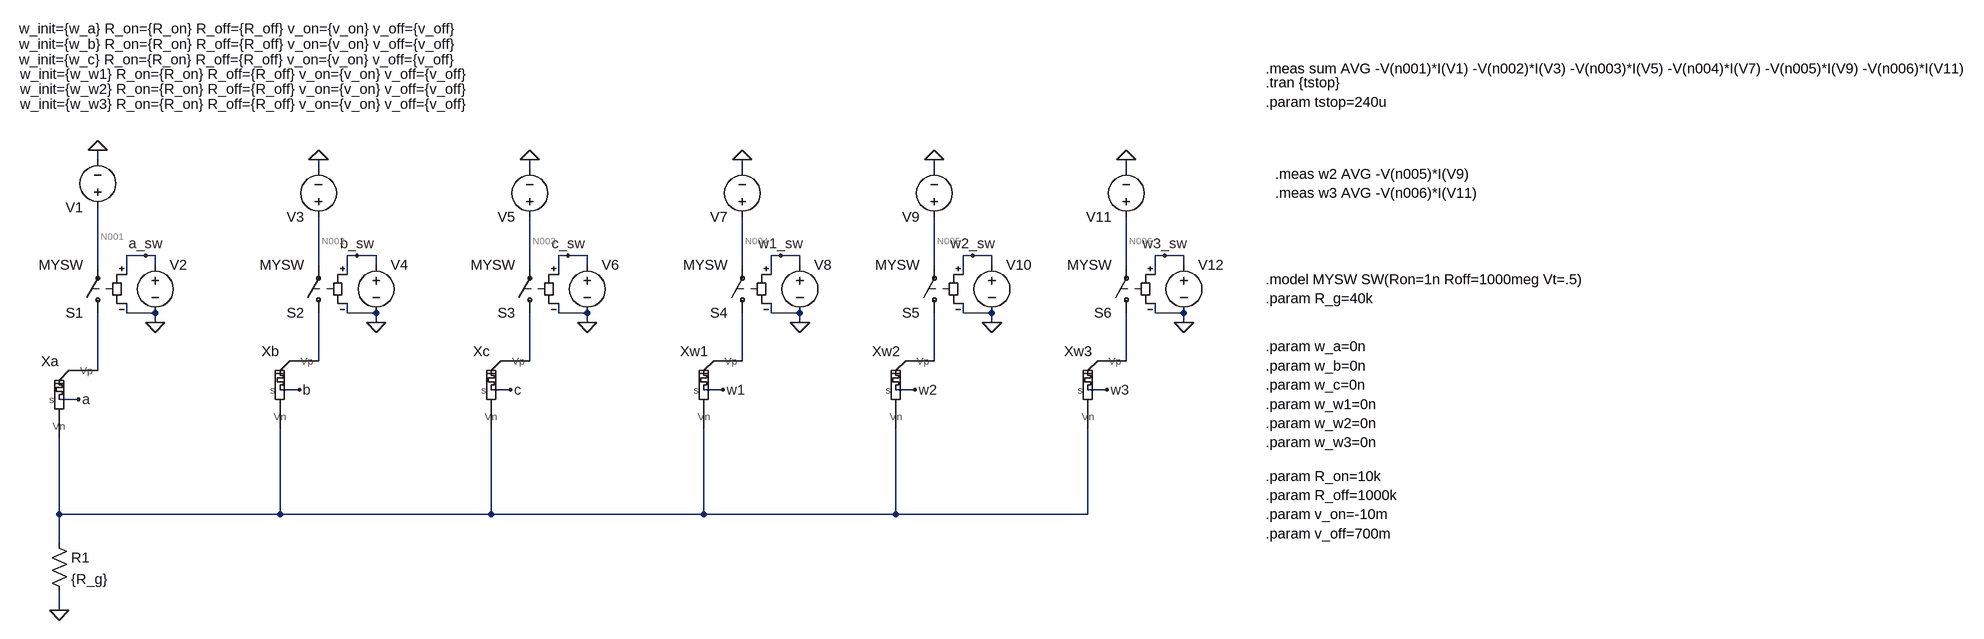
[diagram p0: schematic 1bit_adder_cin.asc]
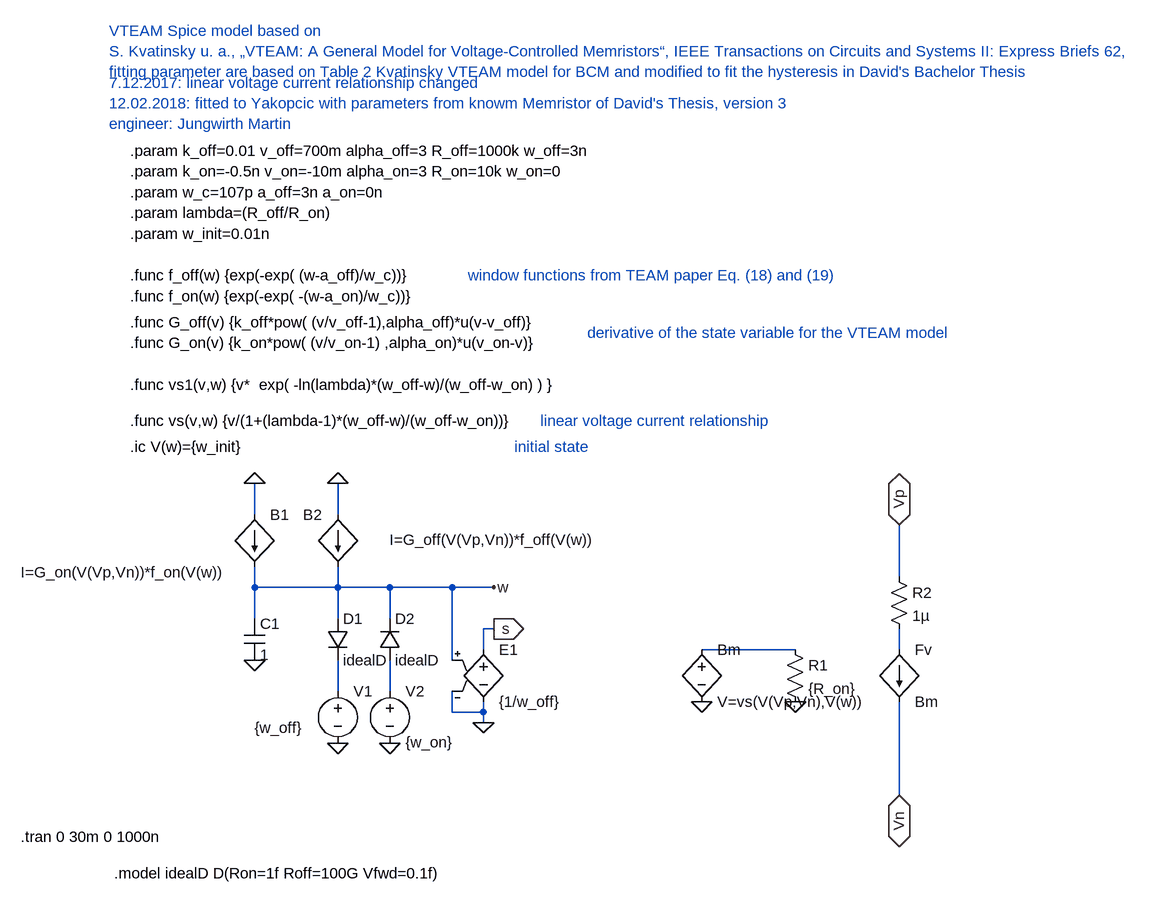
[diagram p1: sub-circuit vteam_knowm.asc]
1bit_adder_cin.asc, the LTspice schematic file:
Version 4
SHEET 1 2472 1840
WIRE -1360 144 -1360 128
WIRE -992 160 -992 144
WIRE -640 160 -640 144
WIRE -224 160 -224 144
WIRE 96 160 96 144
WIRE 416 160 416 144
WIRE -1280 304 -1312 304
WIRE -1264 304 -1280 304
WIRE -928 304 -944 304
WIRE -896 304 -928 304
WIRE -576 304 -592 304
WIRE -544 304 -576 304
WIRE -160 304 -176 304
WIRE -128 304 -160 304
WIRE 160 304 144 304
WIRE 192 304 160 304
WIRE 480 304 464 304
WIRE 512 304 480 304
WIRE -1360 320 -1360 224
WIRE -1264 320 -1264 304
WIRE -992 320 -992 240
WIRE -896 320 -896 304
WIRE -640 320 -640 240
WIRE -544 320 -544 304
WIRE -224 320 -224 240
WIRE -128 320 -128 304
WIRE 96 320 96 240
WIRE 192 320 192 304
WIRE 416 320 416 240
WIRE 512 320 512 304
WIRE -1312 336 -1312 304
WIRE -944 336 -944 304
WIRE -592 336 -592 304
WIRE -176 336 -176 304
WIRE 144 336 144 304
WIRE 464 336 464 304
WIRE -1312 400 -1312 384
WIRE -1264 400 -1312 400
WIRE -944 400 -944 384
WIRE -896 400 -944 400
WIRE -592 400 -592 384
WIRE -544 400 -592 400
WIRE -176 400 -176 384
WIRE -128 400 -176 400
WIRE 144 400 144 384
WIRE 192 400 144 400
WIRE 464 400 464 384
WIRE 512 400 464 400
WIRE -1264 416 -1264 400
WIRE -896 416 -896 400
WIRE -544 416 -544 400
WIRE -128 416 -128 400
WIRE 192 416 192 400
WIRE 512 416 512 400
WIRE -992 480 -992 400
WIRE -640 480 -640 400
WIRE -224 480 -224 400
WIRE 96 480 96 400
WIRE 416 480 416 400
WIRE -1360 496 -1360 400
WIRE -1024 528 -1056 528
WIRE -672 528 -704 528
WIRE -256 528 -288 528
WIRE 64 528 32 528
WIRE 384 528 352 528
WIRE -1392 544 -1424 544
WIRE -1424 736 -1424 608
WIRE -1056 736 -1056 592
WIRE -1056 736 -1424 736
WIRE -704 736 -704 592
WIRE -704 736 -1056 736
WIRE -288 736 -288 592
WIRE -288 736 -704 736
WIRE 32 736 32 592
WIRE 32 736 -288 736
WIRE 352 736 352 592
WIRE 352 736 32 736
WIRE -1424 784 -1424 736
WIRE -1424 896 -1424 864
FLAG -1424 896 0
FLAG -1360 128 0
FLAG -992 144 0
FLAG -1264 416 0
FLAG -896 416 0
FLAG -1024 528 b
FLAG -1280 304 a_sw
FLAG -928 304 b_sw
FLAG -224 144 0
FLAG -128 416 0
FLAG -256 528 w1
FLAG -160 304 w1_sw
FLAG -1392 544 a
FLAG 96 144 0
FLAG 192 416 0
FLAG 64 528 w2
FLAG 160 304 w2_sw
FLAG -640 144 0
FLAG -544 416 0
FLAG -672 528 c
FLAG -576 304 c_sw
FLAG 416 144 0
FLAG 512 416 0
FLAG 384 528 w3
FLAG 480 304 w3_sw
SYMBOL res -1440 768 R0
SYMATTR InstName R1
SYMATTR Value {R_g}
SYMBOL voltage -1360 240 R180
WINDOW 3 24 96 Invisible 2
WINDOW 123 0 0 Left 2
WINDOW 39 0 0 Left 2
SYMATTR Value PWL file=a.csv
SYMATTR InstName V1
SYMBOL voltage -992 256 R180
WINDOW 3 24 96 Invisible 2
WINDOW 123 0 0 Left 2
WINDOW 39 0 0 Left 2
SYMATTR Value PWL file=b.csv
SYMATTR InstName V3
SYMBOL sw -1360 416 R180
SYMATTR InstName S1
SYMATTR Value MYSW
SYMBOL voltage -1264 304 R0
WINDOW 3 24 96 Invisible 2
WINDOW 123 0 0 Left 2
WINDOW 39 0 0 Left 2
SYMATTR Value PWL file=a_sw.csv
SYMATTR InstName V2
SYMBOL sw -992 416 R180
SYMATTR InstName S2
SYMATTR Value MYSW
SYMBOL voltage -896 304 R0
WINDOW 3 24 96 Invisible 2
WINDOW 123 0 0 Left 2
WINDOW 39 0 0 Left 2
SYMATTR Value PWL file=b_sw.csv
SYMATTR InstName V4
SYMBOL VTEAM_knowm -1104 480 R0
WINDOW 39 -23 -513 Bottom 2
SYMATTR SpiceLine w_init={w_b} R_on={R_on} R_off={R_off} v_on={v_on} v_off={v_off}
SYMATTR InstName Xb
SYMBOL voltage -224 256 R180
WINDOW 3 24 96 Invisible 2
WINDOW 123 0 0 Left 2
WINDOW 39 0 0 Left 2
SYMATTR Value PWL file=w1.csv
SYMATTR InstName V7
SYMBOL sw -224 416 R180
SYMATTR InstName S4
SYMATTR Value MYSW
SYMBOL voltage -128 304 R0
WINDOW 3 24 96 Invisible 2
WINDOW 123 0 0 Left 2
WINDOW 39 0 0 Left 2
SYMATTR Value PWL file=w1_sw.csv
SYMATTR InstName V8
SYMBOL VTEAM_knowm -336 480 R0
WINDOW 39 -781 -463 Bottom 2
SYMATTR SpiceLine w_init={w_w1} R_on={R_on} R_off={R_off} v_on={v_on} v_off={v_off}
SYMATTR InstName Xw1
SYMBOL VTEAM_knowm -1472 496 R0
WINDOW 39 345 -555 Bottom 2
SYMATTR SpiceLine w_init={w_a} R_on={R_on} R_off={R_off} v_on={v_on} v_off={v_off}
SYMATTR InstName Xa
SYMBOL voltage 96 256 R180
WINDOW 3 24 96 Invisible 2
WINDOW 123 0 0 Left 2
WINDOW 39 0 0 Left 2
SYMATTR Value PWL file=w2.csv
SYMATTR InstName V9
SYMBOL sw 96 416 R180
SYMATTR InstName S5
SYMATTR Value MYSW
SYMBOL voltage 192 304 R0
WINDOW 3 24 96 Invisible 2
WINDOW 123 0 0 Left 2
WINDOW 39 0 0 Left 2
SYMATTR Value PWL file=w2_sw.csv
SYMATTR InstName V10
SYMBOL VTEAM_knowm -16 480 R0
WINDOW 39 -1101 -438 Bottom 2
SYMATTR SpiceLine w_init={w_w2} R_on={R_on} R_off={R_off} v_on={v_on} v_off={v_off}
SYMATTR InstName Xw2
SYMBOL voltage -640 256 R180
WINDOW 3 24 96 Invisible 2
WINDOW 123 0 0 Left 2
WINDOW 39 0 0 Left 2
SYMATTR Value PWL file=c.csv
SYMATTR InstName V5
SYMBOL sw -640 416 R180
SYMATTR InstName S3
SYMATTR Value MYSW
SYMBOL voltage -544 304 R0
WINDOW 3 24 96 Invisible 2
WINDOW 123 0 0 Left 2
WINDOW 39 0 0 Left 2
SYMATTR Value PWL file=c_sw.csv
SYMATTR InstName V6
SYMBOL VTEAM_knowm -752 480 R0
WINDOW 39 -376 -487 Bottom 2
SYMATTR SpiceLine w_init={w_c} R_on={R_on} R_off={R_off} v_on={v_on} v_off={v_off}
SYMATTR InstName Xc
SYMBOL voltage 416 256 R180
WINDOW 3 24 96 Invisible 2
WINDOW 123 0 0 Left 2
WINDOW 39 0 0 Left 2
SYMATTR Value PWL file=w3.csv
SYMATTR InstName V11
SYMBOL sw 416 416 R180
SYMATTR InstName S6
SYMATTR Value MYSW
SYMBOL voltage 512 304 R0
WINDOW 3 24 96 Invisible 2
WINDOW 123 0 0 Left 2
WINDOW 39 0 0 Left 2
SYMATTR Value PWL file=w3_sw.csv
SYMATTR InstName V12
SYMBOL VTEAM_knowm 304 480 R0
WINDOW 39 -1421 -413 Bottom 2
SYMATTR SpiceLine w_init={w_w3} R_on={R_on} R_off={R_off} v_on={v_on} v_off={v_off}
SYMATTR InstName Xw3
TEXT 648 344 Left 2 !.model MYSW SW(Ron=1n Roff=1000meg Vt=.5)
TEXT 648 376 Left 2 !.param R_g=40k
TEXT 648 16 Left 2 !.tran {tstop}
TEXT 648 456 Left 2 !.param w_a=0n
TEXT 648 488 Left 2 !.param w_b=0n
TEXT 648 520 Left 2 !.param w_c=0n
TEXT 648 552 Left 2 !.param w_w1=0n
TEXT 648 584 Left 2 !.param w_w2=0n
TEXT 648 616 Left 2 !.param w_w3=0n
TEXT 648 672 Left 2 !.param R_on=10k
TEXT 648 704 Left 2 !.param R_off=1000k
TEXT 648 -8 Left 2 !.meas sum AVG -V(n001)*I(V1) -V(n002)*I(V3) -V(n003)*I(V5) -V(n004)*I(V7) -V(n005)*I(V9) -V(n006)*I(V11)
TEXT 648 48 Left 2 !.param tstop=240u
TEXT 664 168 Left 2 !.meas w2 AVG -V(n005)*I(V9)
TEXT 664 200 Left 2 !.meas w3 AVG -V(n006)*I(V11)
TEXT 648 736 Left 2 !.param v_on=-10m
TEXT 648 768 Left 2 !.param v_off=700m

vteam_knowm.asc, the sub-circuit schematic file:
Version 4
SHEET 1 2456 1664
WIRE 208 576 208 528
WIRE 336 576 336 528
WIRE 1200 672 1200 592
WIRE 208 688 208 656
WIRE 336 688 336 656
WIRE 336 688 208 688
WIRE 416 688 336 688
WIRE 512 688 416 688
WIRE 576 688 512 688
WIRE 208 736 208 688
WIRE 336 736 336 688
WIRE 416 736 416 688
WIRE 576 752 560 752
WIRE 560 784 560 752
WIRE 1040 784 896 784
WIRE 1200 784 1200 752
WIRE 512 800 512 688
WIRE 336 848 336 800
WIRE 416 848 416 800
WIRE 512 880 512 848
WIRE 560 880 560 864
WIRE 560 880 512 880
WIRE 560 896 560 880
WIRE 1200 1008 1200 864
FLAG 208 528 0
FLAG 336 528 0
FLAG 208 800 0
FLAG 336 928 0
FLAG 416 928 0
FLAG 576 688 w
FLAG 896 864 0
FLAG 1040 864 0
FLAG 1200 592 Vp
IOPIN 1200 592 BiDir
FLAG 1200 1008 Vn
IOPIN 1200 1008 BiDir
FLAG 560 896 0
FLAG 576 752 s
IOPIN 576 752 Out
SYMBOL bi 208 576 R0
WINDOW 3 -360 89 Left 2
SYMATTR Value I=G_on(V(Vp,Vn))*f_on(V(w))
SYMATTR InstName B1
SYMBOL bi 336 576 M0
WINDOW 3 -396 39 Left 2
SYMATTR Value I=G_off(V(Vp,Vn))*f_off(V(w))
SYMATTR InstName B2
SYMBOL cap 192 736 R0
SYMATTR InstName C1
SYMATTR Value 1
SYMBOL diode 320 736 R0
SYMATTR InstName D1
SYMATTR Value idealD
SYMBOL diode 400 800 M180
WINDOW 0 24 64 Left 2
WINDOW 3 24 0 Left 2
SYMATTR InstName D2
SYMATTR Value idealD
SYMBOL voltage 336 832 R0
WINDOW 123 0 0 Left 2
WINDOW 39 0 0 Left 2
WINDOW 3 -128 72 Left 2
SYMATTR Value {w_off}
SYMATTR InstName V1
SYMBOL voltage 416 832 R0
WINDOW 3 24 94 Left 2
WINDOW 123 0 0 Left 2
WINDOW 39 0 0 Left 2
SYMATTR Value {w_on}
SYMATTR InstName V2
SYMBOL res 1024 768 R0
SYMATTR InstName R1
SYMATTR Value {R_on}
SYMBOL f 1200 784 R0
SYMATTR InstName Fv
SYMATTR Value Bm
SYMATTR Value2 -1
SYMBOL bv 896 768 R0
SYMATTR InstName Bm
SYMATTR Value V=vs(V(Vp,Vn),V(w))
SYMBOL e 560 768 R0
SYMATTR InstName E1
SYMATTR Value {1/w_off}
SYMBOL res 1184 656 R0
SYMATTR InstName R2
SYMATTR Value 1µ
TEXT 16 16 Left 2 !.param k_off=0.01 v_off=700m alpha_off=3 R_off=1000k w_off=3n
TEXT 16 48 Left 2 !.param k_on=-0.5n v_on=-10m alpha_on=3 R_on=10k w_on=0
TEXT 16 80 Left 2 !.param w_c=107p a_off=3n a_on=0n
TEXT 16 208 Left 2 !.func f_off(w) {exp(-exp( (w-a_off)/w_c))}
TEXT 16 240 Left 2 !.func f_on(w) {exp(-exp( -(w-a_on)/w_c))}
TEXT 16 280 Left 2 !.func G_off(v) {k_off*pow( (v/v_off-1),alpha_off)*u(v-v_off)}
TEXT 16 312 Left 2 !.func G_on(v) {k_on*pow( (v/v_on-1) ,alpha_on)*u(v_on-v)}
TEXT 16 432 Left 2 !.func vs(v,w) {v/(1+(lambda-1)*(w_off-w)/(w_off-w_on))}
TEXT -16 -168 Left 2 ;VTEAM Spice model based on \nS. Kvatinsky u. a., „VTEAM: A General Model for Voltage-Controlled Memristors“, IEEE Transactions on Circuits and Systems II: Express Briefs 62,\nfitting parameter are based on Table 2 Kvatinsky VTEAM model for BCM and modified to fit the hysteresis in David's Bachelor Thesis
TEXT 16 112 Left 2 !.param lambda=(R_off/R_on)
TEXT 16 472 Left 2 !.ic V(w)={w_init}
TEXT 536 208 Left 2 ;window functions from TEAM paper Eq. (18) and (19)
TEXT 720 296 Left 2 ;derivative of the state variable for the VTEAM model
TEXT 648 432 Left 2 ;linear voltage current relationship
TEXT 608 472 Left 2 ;initial state
TEXT -8 1128 Left 2 !.model idealD D(Ron=1f Roff=100G Vfwd=0.1f)
TEXT 16 144 Left 2 !.param w_init=0.01n
TEXT -16 -88 Left 2 ;7.12.2017: linear voltage current relationship changed\n12.02.2018: fitted to Yakopcic with parameters from knowm Memristor of David's Thesis, version 3\nengineer: Jungwirth Martin
TEXT -152 1072 Left 2 !.tran 0 30m 0 1000n
TEXT 16 376 Left 2 !.func vs1(v,w) {v*  exp( -ln(lambda)*(w_off-w)/(w_off-w_on) ) }

The netlist it stands for:
* 1bit_adder_cin.asc
R1 N013 0 {R_g}
V1 N001 0 PWL file=a.csv
V3 N002 0 PWL file=b.csv
S1 N012 N001 a_sw 0 MYSW
V2 a_sw 0 PWL file=a_sw.csv
S2 N007 N002 b_sw 0 MYSW
V4 b_sw 0 PWL file=b_sw.csv
XXb b N007 N013 vteam_knowm params: w_init={w_b} R_on={R_on} R_off={R_off} v_on={v_on} v_off={v_off}
V7 N004 0 PWL file=w1.csv
S4 N009 N004 w1_sw 0 MYSW
V8 w1_sw 0 PWL file=w1_sw.csv
XXw1 w1 N009 N013 vteam_knowm params: w_init={w_w1} R_on={R_on} R_off={R_off} v_on={v_on} v_off={v_off}
XXa a N012 N013 vteam_knowm params: w_init={w_a} R_on={R_on} R_off={R_off} v_on={v_on} v_off={v_off}
V9 N005 0 PWL file=w2.csv
S5 N010 N005 w2_sw 0 MYSW
V10 w2_sw 0 PWL file=w2_sw.csv
XXw2 w2 N010 N013 vteam_knowm params: w_init={w_w2} R_on={R_on} R_off={R_off} v_on={v_on} v_off={v_off}
V5 N003 0 PWL file=c.csv
S3 N008 N003 c_sw 0 MYSW
V6 c_sw 0 PWL file=c_sw.csv
XXc c N008 N013 vteam_knowm params: w_init={w_c} R_on={R_on} R_off={R_off} v_on={v_on} v_off={v_off}
V11 N006 0 PWL file=w3.csv
S6 N011 N006 w3_sw 0 MYSW
V12 w3_sw 0 PWL file=w3_sw.csv
XXw3 w3 N011 N013 vteam_knowm params: w_init={w_w3} R_on={R_on} R_off={R_off} v_on={v_on} v_off={v_off}

* block symbol definitions
.subckt vteam_knowm s Vp Vn
B1 0 w I=G_on(V(Vp,Vn))*f_on(V(w))
B2 0 w I=G_off(V(Vp,Vn))*f_off(V(w))
C1 w 0 1
D1 w N003 idealD
D2 N004 w idealD
V1 N003 0 {w_off}
V2 N004 0 {w_on}
R1 N001 0 {R_on}
Fv N002 Vn Bm -1
Bm N001 0 V=vs(V(Vp,Vn),V(w))
E1 s 0 w 0 {1/w_off}
R2 Vp N002 1µ
.param k_off=0.01 v_off=700m alpha_off=3 R_off=1000k w_off=3n
.param k_on=-0.5n v_on=-10m alpha_on=3 R_on=10k w_on=0
.param w_c=107p a_off=3n a_on=0n
.func f_off(w) {exp(-exp( (w-a_off)/w_c))}
.func f_on(w) {exp(-exp( -(w-a_on)/w_c))}
.func G_off(v) {k_off*pow( (v/v_off-1),alpha_off)*u(v-v_off)}
.func G_on(v) {k_on*pow( (v/v_on-1) ,alpha_on)*u(v_on-v)}
.func vs(v,w) {v/(1+(lambda-1)*(w_off-w)/(w_off-w_on))}
* VTEAM Spice model based on
* S. Kvatinsky u. a., „VTEAM: A General Model for Voltage-Controlled Memristors“, IEEE Transactions on Circuits and Systems II: Express Briefs 62,
* fitting parameter are based on Table 2 Kvatinsky VTEAM model for BCM and modified to fit the hysteresis in David's Bachelor Thesis
.param lambda=(R_off/R_on)
.ic V(w)={w_init}
* window functions from TEAM paper Eq. (18) and (19)
* derivative of the state variable for the VTEAM model
* linear voltage current relationship
* initial state
.model idealD D(Ron=1f Roff=100G Vfwd=0.1f)
.param w_init=0.01n
* 7.12.2017: linear voltage current relationship changed
* 12.02.2018: fitted to Yakopcic with parameters from knowm Memristor of David's Thesis, version 3
* engineer: Jungwirth Martin
.tran 0 30m 0 1000n
.func vs1(v,w) {v*  exp( -ln(lambda)*(w_off-w)/(w_off-w_on) ) }
.ends vteam_knowm

.model D D
.lib standard.dio
.model MYSW SW(Ron=1n Roff=1000meg Vt=.5)
.param R_g=40k
.tran {tstop}
.param w_a=0n
.param w_b=0n
.param w_c=0n
.param w_w1=0n
.param w_w2=0n
.param w_w3=0n
.param R_on=10k
.param R_off=1000k
.meas sum AVG -V(n001)*I(V1) -V(n002)*I(V3) -V(n003)*I(V5) -V(n004)*I(V7) -V(n005)*I(V9) -V(n006)*I(V11)
.param tstop=240u
.meas w2 AVG -V(n005)*I(V9)
.meas w3 AVG -V(n006)*I(V11)
.param v_on=-10m
.param v_off=700m
.backanno
.end